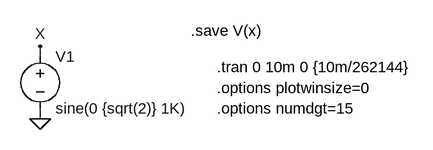
[diagram p0: schematic double.asc]
double.asc, the LTspice schematic file:
Version 4
SHEET 1 880 680
WIRE 128 240 128 224
WIRE 128 336 128 320
FLAG 128 336 0
FLAG 128 224 X
SYMBOL voltage 128 224 R0
SYMATTR InstName V1
SYMATTR Value sine(0 {sqrt(2)} 1K)
TEXT 400 256 Left 0 !.tran 0 10m 0 {10m/262144}
TEXT 400 288 Left 0 !.options plotwinsize=0
TEXT 400 320 Left 0 !.options numdgt=15
TEXT 360 200 Left 0 !.save V(x)

The netlist it stands for:
* double.asc
V1 X 0 sine(0 {sqrt(2)} 1K)
.tran 0 10m 0 {10m/262144}
.options plotwinsize=0
.options numdgt=15
.save V(x)
.backanno
.end